# Altium project PCB_Project1.PrjPCB
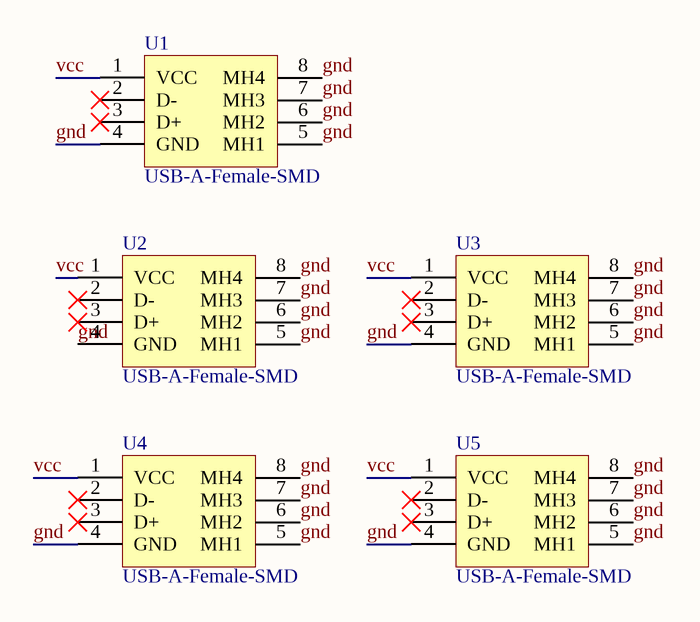
[diagram p0: Sheet1.SchDoc]
1 sheet, 5 parts. Net scope: global (net labels, ports and power ports of the same name join across sheets).
Board file: PCB1.PcbDoc

## Sheet Sheet1.SchDoc
size A4

### Parts
U1  USB-A-Female-SMD  [USB-A-SMD]
U2  USB-A-Female-SMD  [USB-A-SMD]
U3  USB-A-Female-SMD  [USB-A-SMD]
U4  USB-A-Female-SMD  [USB-A-SMD]
U5  USB-A-Female-SMD  [USB-A-SMD]

### Nets
gnd: U1.4(GND) U1.5(MH1) U1.6(MH2) U1.7(MH3) U1.8(MH4) U2.4(GND) U2.5(MH1) U2.6(MH2) U2.7(MH3) U2.8(MH4) U3.4(GND) U3.5(MH1) U3.6(MH2) U3.7(MH3) U3.8(MH4) U4.4(GND) U4.5(MH1) U4.6(MH2) U4.7(MH3) U4.8(MH4) U5.4(GND) U5.5(MH1) U5.6(MH2) U5.7(MH3) U5.8(MH4)
vcc: U1.1(VCC) U2.1(VCC) U3.1(VCC) U4.1(VCC) U5.1(VCC)

Not connected (* = marked no-connect by the designer): U1 2(D-)* 3(D+)*; U2 2(D-)* 3(D+)*; U3 2(D-)* 3(D+)*; U4 2(D-)* 3(D+)*; U5 2(D-)* 3(D+)*